# Altium schematic sheet BMU_V50_CellBalanceIC.SchDoc
size C
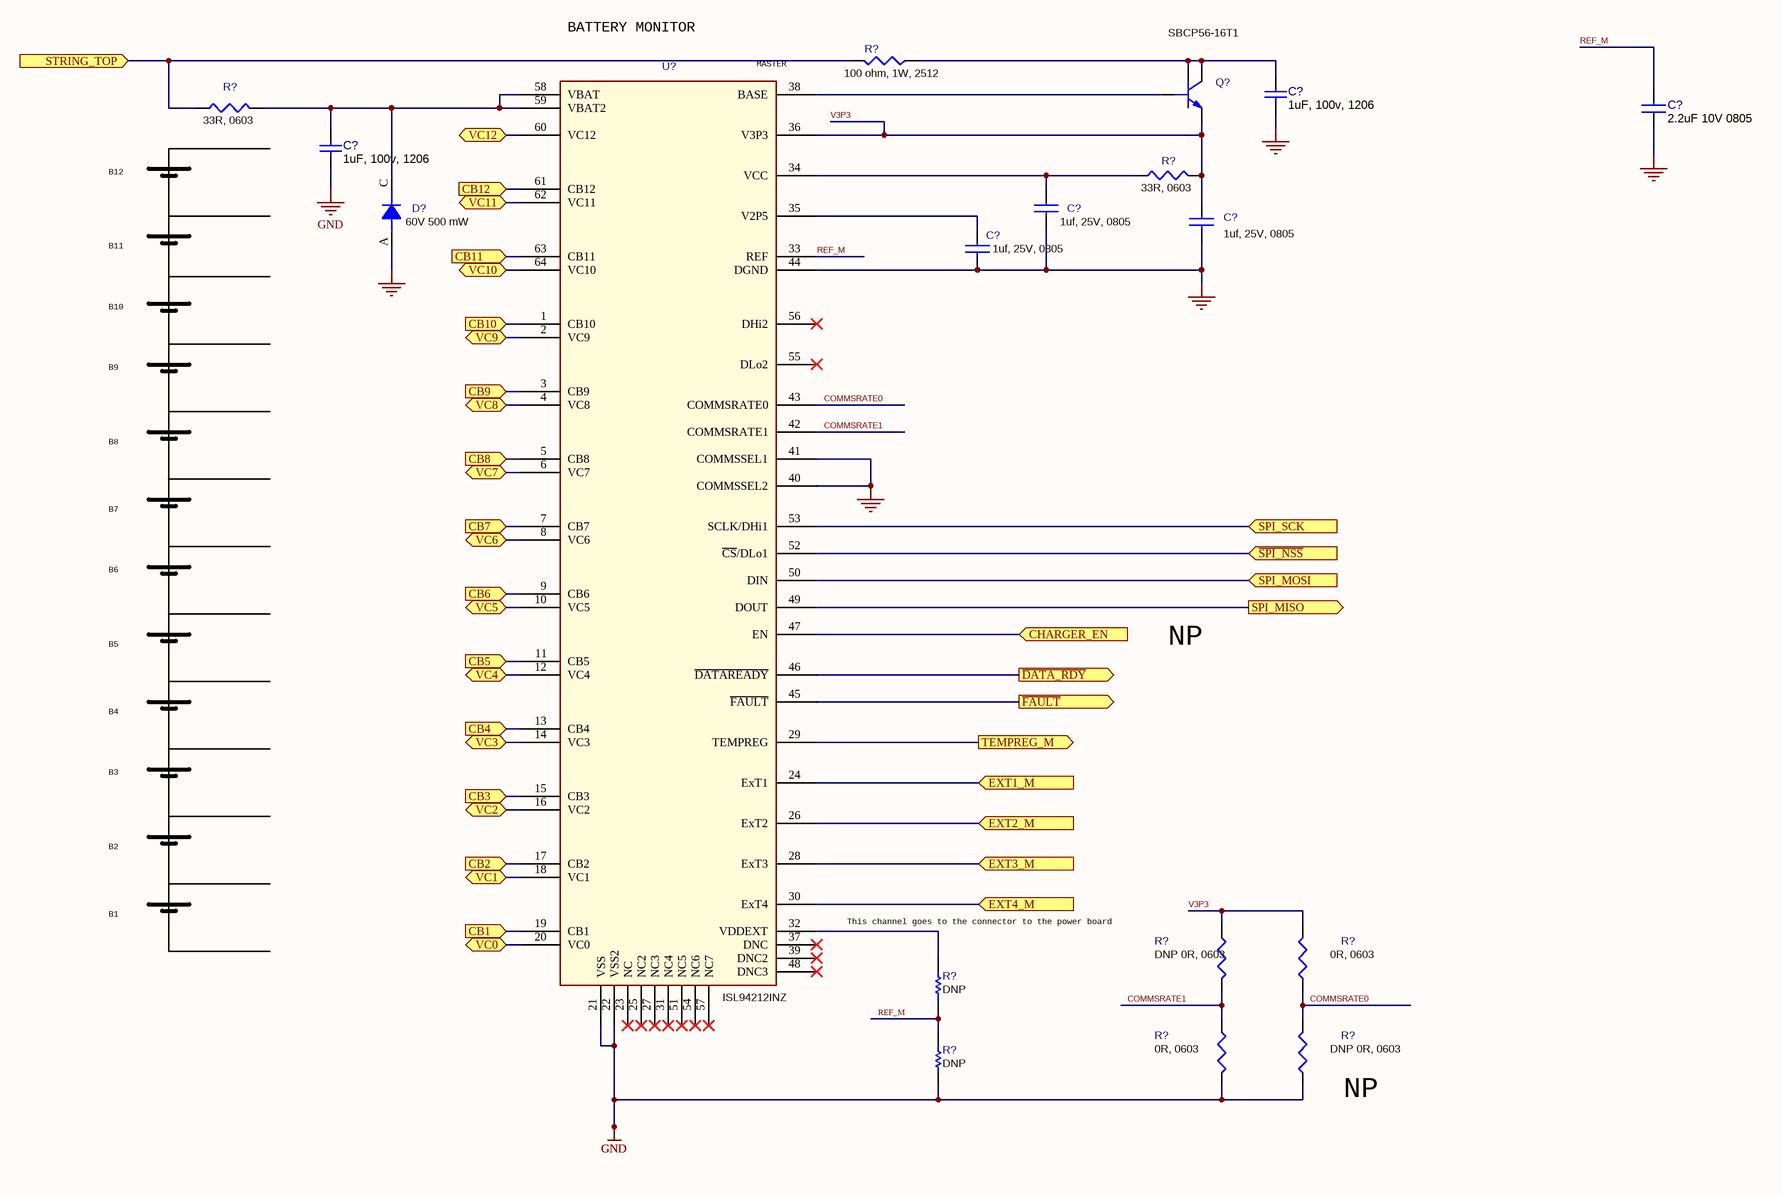
[diagram p0: BMU_V50_CellBalanceIC.SchDoc]

## Parts
(Parts that share a designator on the sheet are numbered #1, #2 ... from top to bottom, then left to right.)
C?#1  1uF, 100v, 1206  [C1206]
C?#2  2.2uF 10V 0805  [C0805]
C?#3  1uF, 100v, 1206  [C1206]
C?#4  1uf, 25V, 0805  [C0805]
C?#5  1uf, 25V, 0805  [C0805]
C?#6  1uf, 25V, 0805  [C0805]
D?  60V 500 mW  [SOD-123]
Q?  SBCP56-16T1  [SOT-223]
R?#1  100 ohm, 1W, 2512  [2512]
R?#2  33R, 0603  [R0603]
R?#3  33R, 0603  [R0603]
R?#4  DNP 0R, 0603  [R0603]  (no BOM)
R?#5  0R, 0603  [R0603]
R?#6  DNP  [R0402]  (no BOM)
R?#7  0R, 0603  [R0603]
R?#8  DNP 0R, 0603  [R0603]  (no BOM)
R?#9  DNP  [R0402]  (no BOM)
U?  ISL94212INZ  [TQFP-64]

## Ports
CB1 (in), CB2 (in), CB3 (in), CB4 (in), CB5 (in), CB6 (in), CB7 (in), CB8 (in), CB9 (in), CB10 (in), CB11 (in), CB12 (in), CHARGER_EN (in), EXT1_M (in), EXT2_M (in), EXT3_M (in), EXT4_M (in), SPI_MISO (out), SPI_MOSI (in), SPI_SCK (in), STRING_TOP (in), TEMPREG_M (out), VC0 (bidir), VC1 (bidir), VC2 (bidir), VC3 (bidir), VC4 (bidir), VC5 (bidir), VC6 (bidir), VC7 (bidir), VC8 (bidir), VC9 (bidir), VC10 (bidir), VC11 (bidir), VC12 (bidir), ~{DATA_RDY} (out), ~{FAULT} (out), ~{SPI_NSS} (in)

## Nets
GND: C?#1.2 C?#2.1 C?#3.1 C?#4.2 C?#5.2 C?#6.2 D?.A(ANODE) R?#7.2 R?#8.2 R?#9.1 U?.21(VSS) U?.22(VSS2) U?.40(COMMSSEL2) U?.41(COMMSSEL1) U?.44(DGND)
CB1: U?.19(CB1) ; port CB1
CB2: U?.17(CB2) ; port CB2
CB3: U?.15(CB3) ; port CB3
CB4: U?.13(CB4) ; port CB4
CB5: U?.11(CB5) ; port CB5
CB6: U?.9(CB6) ; port CB6
CB7: U?.7(CB7) ; port CB7
CB8: U?.5(CB8) ; port CB8
CB9: U?.3(CB9) ; port CB9
CB10: U?.1(CB10) ; port CB10
CB11: U?.63(CB11) ; port CB11
CB12: U?.61(CB12) ; port CB12
CHARGER_EN: U?.47(EN) ; port CHARGER_EN
COMMSRATE0: R?#5.2 R?#8.1 U?.43(COMMSRATE0)
COMMSRATE1: R?#4.2 R?#7.1 U?.42(COMMSRATE1)
~{DATA_RDY}: U?.46(~{DATAREADY}) ; port ~{DATA_RDY}
EXT1_M: U?.24(ExT1) ; port EXT1_M
EXT2_M: U?.26(ExT2) ; port EXT2_M
EXT3_M: U?.28(ExT3) ; port EXT3_M
EXT4_M: U?.30(ExT4) ; port EXT4_M
~{FAULT}: U?.45(~{FAULT}) ; port ~{FAULT}
REF_M: C?#2.2 R?#6.1 R?#9.2 U?.33(REF)
~{SPI_NSS}: U?.52(~{CS}/DLo1) ; port ~{SPI_NSS}
SPI_MISO: U?.49(DOUT) ; port SPI_MISO
SPI_MOSI: U?.50(DIN) ; port SPI_MOSI
SPI_SCK: U?.53(SCLK/DHi1) ; port SPI_SCK
STRING_TOP: R?#1.2 R?#2.1 ; port STRING_TOP
TEMPREG_M: U?.29(TEMPREG) ; port TEMPREG_M
V3P3: C?#5.1 Q?.3(E) R?#3.2 R?#4.1 R?#5.1 U?.36(V3P3)
VC0: U?.20(VC0) ; port VC0
VC1: U?.18(VC1) ; port VC1
VC2: U?.16(VC2) ; port VC2
VC3: U?.14(VC3) ; port VC3
VC4: U?.12(VC4) ; port VC4
VC5: U?.10(VC5) ; port VC5
VC6: U?.8(VC6) ; port VC6
VC7: U?.6(VC7) ; port VC7
VC8: U?.4(VC8) ; port VC8
VC9: U?.2(VC9) ; port VC9
VC10: U?.64(VC10) ; port VC10
VC11: U?.62(VC11) ; port VC11
VC12: U?.60(VC12) ; port VC12
NetC?#1_1: C?#1.1 Q?.2(C) Q?.4(C) R?#1.1
NetC?#3_2: C?#3.2 D?.C(CATHODE) R?#2.2 U?.58(VBAT) U?.59(VBAT2)
NetC?#4_1: C?#4.1 R?#3.1 U?.34(VCC)
NetC?#6_1: C?#6.1 U?.35(V2P5)
NetQ?_1: Q?.1(B) U?.38(BASE)
NetR?#6_2: R?#6.2 U?.32(VDDEXT)

Not connected (* = marked no-connect by the designer): U? 23(NC)* 25(NC2)* 27(NC3)* 31(NC4)* 37(DNC)* 39(DNC2)* 48(DNC3)* 51(NC5)* 54(NC6)* 55(DLo2)* 56(DHi2)* 57(NC7)*

## Notes on the sheet
- BATTERY MONITOR
- (near U?) MASTER
- B12
- B11
- B10
- B9
- B8
- B7
- B6
- B5
- NP
- B4
- B3
- B2
- B1
- (near R?#6) This channel goes to the connector to the power board
- (near R?#8) NP
- Title
- MATTERNET
- PROPRIETRY & CONFIDENTIAL
  THE INFORMATION CONTAINS IN THIS DRAWING
  IS THE SOLE PROPERTY OF  MATTERNET Inc.
  ANY REPRODUCTION IN PART OR AS WHOLE
  WITHOUT A WRITTEN PERMISSION OF
  MATTERNET Inc. IS PROHIBITED
- Size:
- Date:
- File:
- C
- Number:
- Time:
- Revision:
- Sheet
- of
- 161 E. Evelyn Ave.
- Mountain View,
- CA 94041 USA

## Library data of the parts
C?#1 C?#3 = Cap: CAP CER 1UF 100V X7R 1210 AUTO F; Manufacturer: KEMET; Manufacturer Part Number: C1210X105K1RACAUTO; Dielectric Material: Ceramic; Tolerance: 10%; Supplier 1: Digi-Key; Supplier Part Number 1: 399-16434-1-ND; Stock 1: 335; Pricing 1: 1=2.07, 10=1.677, 100=1.2803, 500=0.9755, 1000=0.85356 (USD); Case/Package: 1210; Voltage Rating (DC): 100V; Dielectric: X7R; Capacitance: 1uF
C?#2 = CAP-Generic-0805: CAP CER 2.2UF 10V 10% X7R 0805; Manufacturer: KEMET; Manufacturer Part Number: C0805X225K8RACAUTO; Dielectric Material: Ceramic; Supplier 1: Digi-Key; Supplier Part Number 1: 399-11602-1-ND; Stock 1: 2328; Pricing 1: 1=0.9, 10=0.667, 100=0.4571, 500=0.36184, 1000=0.3047 (USD); Mount: Surface Mount; Case/Package: 0805; Case Code (Metric): 2012; Case Code (Imperial): 0805; Min Operating Temperature: -55°C; Max Operating Temperature: 125°C; Packaging: Tape and Reel; Capacitance: 2.2uF; Voltage Rating: 10V; Tolerance: 10%; Voltage Rating (DC): 10V; Dielectric: X7R; Features: Soft Termination; Length: 0.079inch; Width: 0.049inch; Thickness: 0.055inch; Ratings: AEC-Q200; Supplier 2: Mouser; Supplier Part Number 2: 80-C0805X225K8RAUTO; Stock 2: 4965; Pricing 2: 1=1.06, 10=0.715, 50=0.715, 100=0.446, 1000=0.369, 10000=0.228 (USD)
C?#4-C?#6 = CAP-Generic-0402: CAP CER 1UF 25V X7R 0805; Manufacturer: Murata; Manufacturer Part Number: GCJ21BR71E105KA12L; Tolerance: 10%; Supplier 1: Digi-Key; Supplier Part Number 1: 490-5802-1-ND; Stock 1: 116649; Pricing 1: 1=0.48, 10=0.333, 100=0.1997, 500=0.14974, 1000=0.12645 (USD); Mount: Surface Mount; Case/Package: 0805; Case Code (Imperial): 0805; Case Code (Metric): 2012; Min Operating Temperature: -55°C; Max Operating Temperature: 125°C; Capacitance: 1uF; Voltage Rating: 25V; Voltage Rating (DC): 25V; Packaging: Tape and Reel; Package Quantity: 3000; Dielectric: X7R; Termination: SMD/SMT; Features: Soft Termination; Length: 2mm; Width: 1.25mm; Thickness: 0.057inch; Depth: 1.25mm; Ratings: AEC-Q200; Lead Free: Lead Free
D? = DIO-GENERIC: DIODE ZENER 60V 500MW SOD123; Manufacturer: ON Semiconductor; Manufacturer Part Number: MMSZ5264BT1G; custprt: 100-0500-000184; custinv: Ansync; Option: AB; Material: Plastic; Tolerance: 5%; Impedance: 170R; Forward Voltage: 900mV; Max Reverse Leakage Current: 100nA; Zener Current: 10mA; Test Current: 2.1mA; Element Configuration: Single; ESD Protection: Yes; Supplier 1: Digi-Key; Supplier Part Number 1: MMSZ5264BT1GOSCT-ND; Stock 1: 0; Pricing 1: 1=0.25, 10=0.201, 100=0.1067, 500=0.07016, 1000=0.04771 (USD); Case/Package: SOD-123-2; Number of Pins: 2; Contact Plating: Matte,Tin; Min Operating Temperature: -55°C; Max Operating Temperature: 150°C; Packaging: Tape and Reel; Max Power Dissipation: 500mW; Zener Voltage: 60V; Voltage Rating (DC): 60V; Power Rating: 500mW; Package Quantity: 1; Voltage Tolerance: 5%; Power Dissipation: 500mW; Working Voltage: 60V; Peak Reverse Current: 100nA; Length: 2.84mm; Height: 1.25mm; Width: 1.8mm; Radiation Hardening: No; Lead Free: Lead Free; ComponentLink1URL: http://www.onsemi.com/pub/Collateral/MMSZ5221BT1-D.PDF; ComponentLink1Description: http://www.onsemi.com/pub/Collateral/MMSZ5221BT1-D.PDF; ComponentLink2URL: https://www.verical.com/server-webapp/html/getDatasheet?partID=107391; ComponentLink2Description: https://www.verical.com/server-webapp/html/getDatasheet?partID=107391; ComponentLink3URL: http://www.mouser.com/ds/2/308/MMSZ5221BT1-D-85810.pdf; ComponentLink3Description: http://www.mouser.com/ds/2/308/MMSZ5221BT1-D-85810.pdf; ComponentLink4URL: http://www.onsemi.com/pub_link/Collateral/MMSZ5221BT1-D.PDF; ComponentLink4Description: http://www.onsemi.com/pub_link/Collateral/MMSZ5221BT1-D.PDF; ComponentLink5URL: http://uk.rs-online.com/webdocs/1276/0900766b81276af2.pdf; ComponentLink5Description: http://uk.rs-online.com/webdocs/1276/0900766b81276af2.pdf; Supplier 2: Mouser; Supplier Part Number 2: 863-MMSZ5264BT1G; Stock 2: 694; Pricing 2: 1=0.23, 10=0.156, 50=0.156, 100=0.065, 1000=0.045, 10000=0.03 (USD)
Q? = Trans-Generic_2: TRANS NPN 80V 1.0A SOT-223; Manufacturer: ON Semiconductor; Manufacturer Part Number: SBCP56-16T1G; Max Power Dissipation: 1.5W; Frequency: 130MHz; hFE Min: 25; Max Collector Current: 1A; Collector Emitter Saturation Voltage: 500mV; Collector Base Voltage (VCBO): 100V; Number of Elements: 1; Emitter Base Voltage (VEBO): 5V; Element Configuration: Single; Supplier 1: Digi-Key; Supplier Part Number 1: SBCP56-16T1GOSCT-ND; Stock 1: 10870; Pricing 1: 1=0.59, 10=0.505, 100=0.3767, 500=0.29598 (USD); Case/Package: SOT-223-4; Number of Pins: 4; Min Operating Temperature: -65°C; Max Operating Temperature: 150°C; Package Quantity: 1000; Packaging: Tape and Reel; Collector Emitter Voltage (VCEO): 80V; Transition Frequency: 130MHz; Collector Emitter Breakdown Voltage: 80V; Polarity: NPN; Max Breakdown Voltage: 80V; Power Dissipation: 1.5W; Gain Bandwidth Product: 130MHz; Max Frequency: 130MHz; Length: 6.7mm; Height: 1.65mm; Width: 3.7mm; Radiation Hardening: No; Lead Free: Lead Free; ComponentLink1URL: http://www.onsemi.com/pub/Collateral/BCP56T1-D.PDF?src-supplier=Digi-Key; ComponentLink1Description: http://www.onsemi.com/pub/Collateral/BCP56T1-D.PDF?src-supplier=Digi-Key; ComponentLink2URL: http://www.onsemi.com/pub_link/Collateral/BCP56T1-D.PDF?src-supplier=Future+Electronics; ComponentLink2Description: http://www.onsemi.com/pub_link/Collateral/BCP56T1-D.PDF?src-supplier=Future+Electronics; ComponentLink3URL: http://www.onsemi.com/pub/Collateral/BCP56T1-D.PDF?src-supplier=Avnet+Europe; ComponentLink3Description: http://www.onsemi.com/pub/Collateral/BCP56T1-D.PDF?src-supplier=Avnet+Europe; Supplier 2: Mouser; Supplier Part Number 2: 863-SBCP56-16T1G; Stock 2: 108192; Pricing 2: 1=0.55, 10=0.45, 50=0.45, 100=0.274, 1000=0.212, 10000=0.168 (USD)
R?#1 = R-Generic: RES SMD 100 OHM 5% 1W 2512; Manufacturer: Panasonic; Manufacturer Part Number: ERJ-1TYJ101U; custprt: 100-0100-000214; custinv: Ansync; Option: AB; Resistance: 100R; Temperature Coefficient: 200ppm/°C; Voltage Rating: 200V; Voltage Rating (DC): 250V; Supplier 1: Mouser; Supplier Part Number 1: 667-ERJ-1TYJ101U; Stock 1: 275; Pricing 1: 1=0.39, 10=0.28, 50=0.169, 100=0.125, 1000=0.07, 10000=0.053 (USD); Mount: Surface Mount; Case/Package: 2512; Contact Plating: Tin; Case Code (Metric): 6432; Case Code (Imperial): 2512; Min Operating Temperature: -55°C; Max Operating Temperature: 155°C; Tolerance: 5%; Power Rating: 1W; Composition: Thick Film; Packaging: Tape and Reel; Package Quantity: 4000; Number of Terminations: 2; Termination: SMD/SMT; Military Standard: Not; Max Power Dissipation: 1W; Features: Automotive AEC-Q200; Length: 6.4mm; Height: 0.6mm; Width: 0.126inch; Depth: 3.2mm; Radiation Hardening: No; REACH SVHC: No SVHC; Lead Free: Lead Free; ComponentLink1URL: http://www.farnell.com/datasheets/1678796.pdf; ComponentLink1Description: http://www.farnell.com/datasheets/1678796.pdf; ComponentLink2URL: http://industrial.panasonic.com/www-data/pdf/AOA0000/AOA0000CE1.pdf; ComponentLink2Description: http://industrial.panasonic.com/www-data/pdf/AOA0000/AOA0000CE1.pdf; ComponentLink3URL: http://www.mouser.com/ds/2/315/AOA0000C84-947596.pdf; ComponentLink3Description: http://www.mouser.com/ds/2/315/AOA0000C84-947596.pdf; ComponentLink4URL: https://www.alliedelec.com/m/d/51cd0790071e1666bdb9d00c57fcf960.pdf; ComponentLink4Description: https://www.alliedelec.com/m/d/51cd0790071e1666bdb9d00c57fcf960.pdf
R?#2 R?#3 = R-Generic-0603: RES SMD 33 OHM 1% 1/10W 0603; Manufacturer: Yageo; Manufacturer Part Number: AC0603FR-0733RL; custprt: 100-0110-000153; custinv: Ansync; Option: AB; Power Rating: 100mW; Voltage Rating: 50V; Temperature Coefficient: 100ppm/°C; Supplier 1: Digi-Key; Supplier Part Number 1: YAG3599CT-ND; Stock 1: 70551; Pricing 1: 1=0.1, 10=0.032, 100=0.0129, 1000=0.00579, 2500=0.00502 (USD); Case/Package: 0603; Case Code (Imperial): 0603; Case Code (Metric): 1608; Min Operating Temperature: -55°C; Max Operating Temperature: 155°C; Packaging: Tape and Reel; Resistance: 33R; Tolerance: 1%; Composition: Thick Film; Termination: SMD/SMT; Number of Terminations: 2; Max Power Dissipation: 100mW; Features: Automotive AEC-Q200,Moisture Resistant; Length: 0.063inch; Height: 0.022inch; Width: 0.8mm
R?#4 R?#8 = R-Generic-0402: DNP; custinv: Ansync; custprt: 100-0120-000002; Option: N
R?#5 R?#7 = R-Generic-0402: RES SMD 0 OHM JUMPER 1/10W 0603; Manufacturer: Yageo; Manufacturer Part Number: RC0603FR-070RL; custinv: Ansync; custprt: 100-0120-000002; Option: AB; Resistance: 0mR; Power Rating: 100mW; Tolerance: 1%; Voltage Rating (DC): 50V; Temperature Coefficient: 200ppm/°C; Current Rating: 1A; Working Voltage: 75V; Supplier 1: Digi-Key; Supplier Part Number 1: 311-0.0HRCT-ND; Stock 1: 3289463; Pricing 1: 1=0.1, 10=0.021, 25=0.0152, 50=0.0114, 100=0.0084, 250=0.00644, 500=0.00514, 1000=0.00379 (USD); Case/Package: 0603; Number of Pins: 2; Contact Plating: Matte,Tin; Case Code (Metric): 1608; Case Code (Imperial): 0603; Min Operating Temperature: -55°C; Max Operating Temperature: 155°C; Composition: Thick Film; Packaging: Tape and Reel; Package Quantity: 5000; Voltage Rating: 50V; Number of Terminations: 2; Termination: SMD/SMT; Military Standard: Not; Max Power Dissipation: 100mW; Features: Moisture Resistant; Length: 1.6mm; Height: 0.45mm; Width: 0.031inch; Depth: 0.8mm; Radiation Hardening: No; REACH SVHC: No SVHC; Lead Free: Lead Free; ComponentLink1URL: http://www.farnell.com/datasheets/1868787.pdf; ComponentLink1Description: http://www.farnell.com/datasheets/1868787.pdf; ComponentLink2URL: http://www.farnell.com/datasheets/443971.pdf; ComponentLink2Description: http://www.farnell.com/datasheets/443971.pdf; ComponentLink3URL: http://www.yageo.com/documents/recent/PYu-RC_Group_51_RoHS_L_9.pdf; ComponentLink3Description: http://www.yageo.com/documents/recent/PYu-RC_Group_51_RoHS_L_9.pdf; ComponentLink4URL: http://documents.rs-components.com/techlib://itc_doclist_GB.htm?stockno=5048827; ComponentLink4Description: http://documents.rs-components.com/techlib://itc_doclist_GB.htm?stockno=5048827
R?#6 R?#9 = Res1: Resistor; Published: 8-Jun-2000; LatestRevisionDate: 17-Jul-2002; LatestRevisionNote: Re-released for DXP Platform.; PackageReference: AXIAL-0.3; Publisher: Altium Limited; PackageDescription: Axial Device, Thru-Hole; 2 Leads; 0.3 in Pin Spacing
U? = BATTMAN-ISL94212INZ-700-498: Battery Management Multi-Cell Li-Ion Battery Manager; Manufacturer: Renesas; Option: AB; Max Supply Current: 5mA; Mount: Surface Mount; Case/Package: QFP; Number of Pins: 64; Min Operating Temperature: -40°C; Max Operating Temperature: 85°C; Package Quantity: 160; Packaging: Tray; Radiation Hardening: No; ComponentLink1URL: http://www.intersil.com/products/deviceinfo.asp?pn=ISL94212; ComponentLink1Description: http://www.intersil.com/products/deviceinfo.asp?pn=ISL94212; ComponentLink2URL: http://www.intersil.com/content/dam/Intersil/documents/isl9/isl94212.pdf; ComponentLink2Description: http://www.intersil.com/content/dam/Intersil/documents/isl9/isl94212.pdf; Supplier 1: Mouser; Supplier Part Number 1: 968-ISL94212INZ; Stock 1: 447; Pricing 1: 1=11.53, 10=10.42, 50=9.94, 100=8.63, 1000=6.55, 10000=6.55 (USD); Manufacturer Part Number: ISL94212INZ